# Altium schematic sheet portal.SchDoc
size A4; SheetNumber: 1; SheetTotal: 1
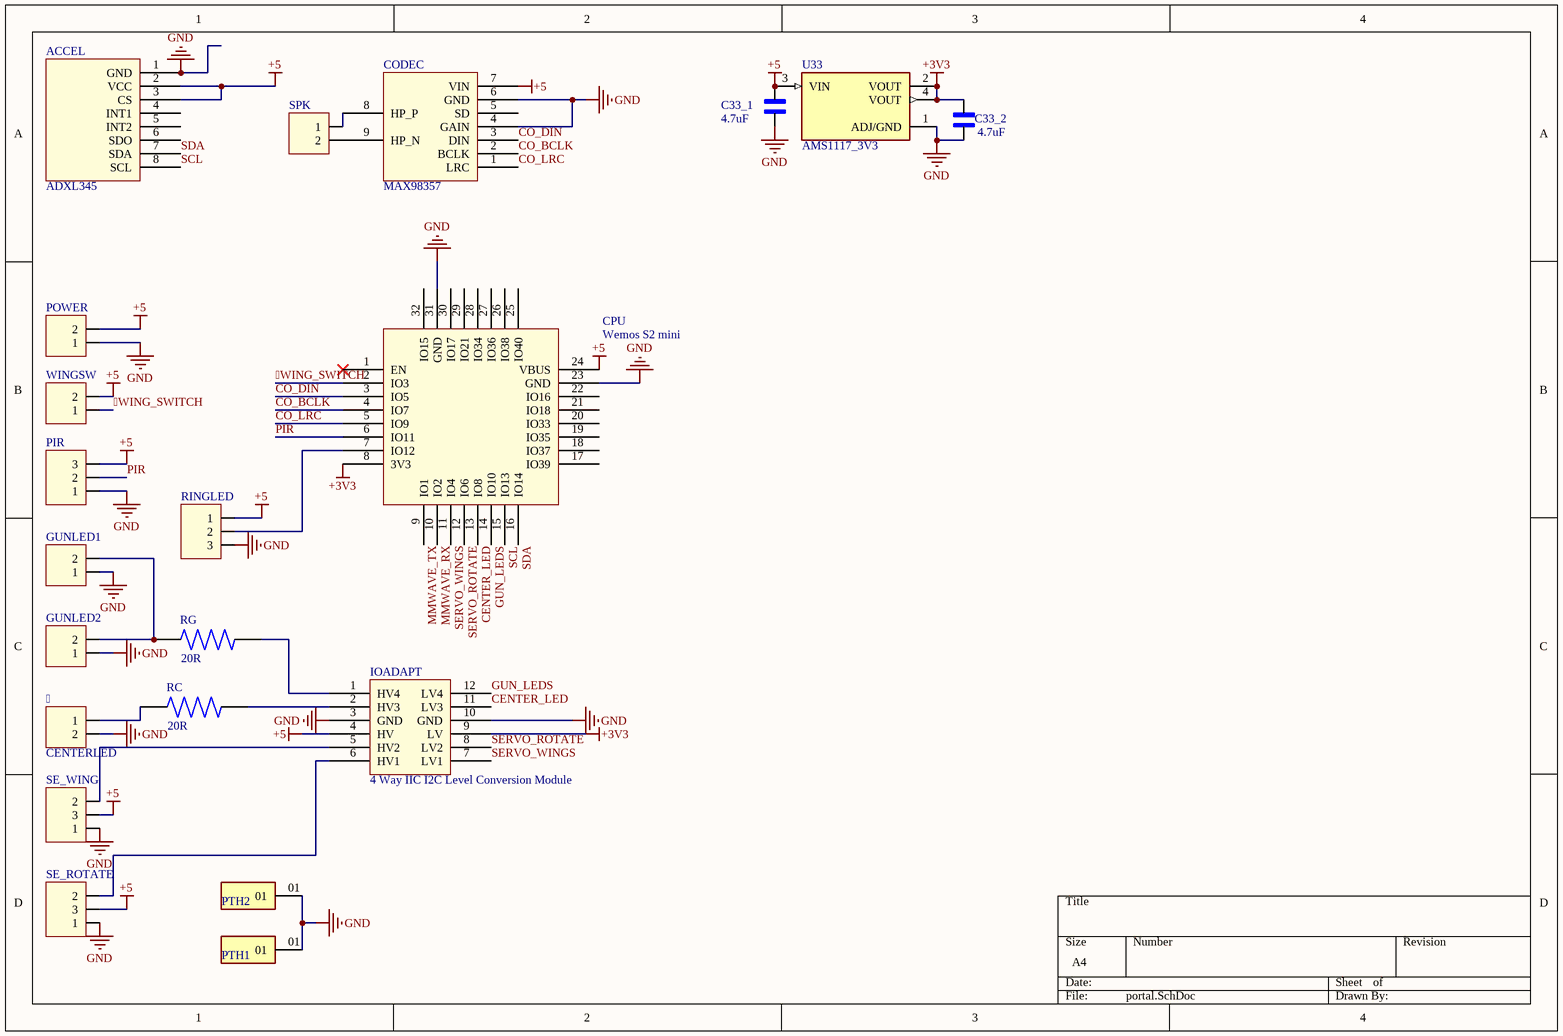
[diagram p0: portal.SchDoc]

## Parts
  CENTERLED  [HEADER 2]
ACCEL  ADXL345  [ADXL345]
C33_1  value 4.7uF  [RESC1508X55N]  (hidden comment: 5uF)
C33_2  value 4.7uF  [RESC1508X55N]  (hidden comment: 5uF)
CODEC  MAX98357  [MAX98357]
CPU  Wemos S2 mini  [WEMOS S2 mini]
GUNLED1  (no value)  [HEADER 2]
GUNLED2  (no value)  [HEADER 2]
IOADAPT  4 Way IIC I2C Level Conversion Module  [IOADAPT]
PIR  (no value)  [HEADER 3]
POWER  (no value)  [HEADER 2]
PTH1  MTSW-101-22-T-S-395  [SAMTEC_MTSW-101-22-T-S-395]  (value not drawn)
PTH2  MTSW-101-22-T-S-395  [SAMTEC_MTSW-101-22-T-S-395]  (value not drawn)
RC  20R  [RESC1607X60N]
RG  20R  [RESC1607X60N]
RINGLED  (no value)  [HEADER 3]
SE_ROTATE  (no value)  [HEADER 3]
SE_WING  (no value)  [HEADER 3]
SPK  (no value)  [HEADER 2]
U33  AMS1117_3V3  [SOT229P700X180-4N]
WINGSW  (no value)  [HEADER 2]

## Nets
+3V3: C33_2.1 CPU.8(3V3) IOADAPT.9(LV) U33.2(VOUT) U33.4(VOUT)
+5: ACCEL.2(VCC) ACCEL.3(CS) C33_1.1 CODEC.7(VIN) CPU.24(VBUS) IOADAPT.4(HV) PIR.3 POWER.2 RINGLED.1 SE_ROTATE.3 SE_WING.3 U33.3(VIN) WINGSW.2
GND: .2 ACCEL.1(GND) C33_1.2 C33_2.2 CODEC.4(GAIN) CODEC.6(GND) CPU.23(GND) CPU.31(GND) GUNLED1.1 GUNLED2.1 IOADAPT.3(GND) IOADAPT.10(GND) PIR.1 POWER.1 PTH1.01 PTH2.01 RINGLED.3 SE_ROTATE.1 SE_WING.1 U33.1(ADJ/GND)
WING_SWITCH: CPU.2(IO3) WINGSW.1
CENTER_LED: CPU.13(IO8) IOADAPT.11(LV3)
CO_BCLK: CODEC.2(BCLK) CPU.4(IO7)
CO_DIN: CODEC.3(DIN) CPU.3(IO5)
CO_LRC: CODEC.1(LRC) CPU.5(IO9)
GUN_LEDS: CPU.14(IO10) IOADAPT.12(LV4)
MMWAVE_RX: CPU.10(IO2)
MMWAVE_TX: CPU.9(IO1)
PIR: CPU.6(IO11) PIR.2
SCL: ACCEL.8(SCL) CPU.15(IO13)
SDA: ACCEL.7(SDA) CPU.16(IO14)
SERVO_ROTATE: CPU.12(IO6) IOADAPT.8(LV2)
SERVO_WINGS: CPU.11(IO4) IOADAPT.7(LV1)
Net_1: .1 RC.1
NetCODEC_8: CODEC.8(HP_P) SPK.1
NetCODEC_9: CODEC.9(HP_N) SPK.2
NetCPU_7: CPU.7(IO12) RINGLED.2
NetGUNLED1_2: GUNLED1.2 GUNLED2.2 RG.1
NetIOADAPT_1: IOADAPT.1(HV4) RG.2
NetIOADAPT_2: IOADAPT.2(HV3) RC.2
NetIOADAPT_5: IOADAPT.5(HV2) SE_WING.2
NetIOADAPT_6: IOADAPT.6(HV1) SE_ROTATE.2

Not connected (* = marked no-connect by the designer): ACCEL 4(INT1) 5(INT2) 6(SDO); CODEC 5(SD); CPU 1(EN)* 17(IO39) 18(IO37) 19(IO35) 20(IO33) 21(IO18) 22(IO16) 25(IO40) 26(IO38) 27(IO36) 28(IO34) 29(IO21) 30(IO17) 32(IO15)

## Library data of the parts
 GUNLED1 GUNLED2 POWER SPK WINGSW = HEADER 2
C33_1 C33_2 = GJM0335C1E220GB01D: MF: {'manufacturer': u'Murata'}; Package: None; Price: None; MP: GJM0335C1E220GB01D; Availability: Unavailable
IOADAPT = IO Adapt
PIR RINGLED SE_ROTATE SE_WING = HEADER 3
PTH1 PTH2 = MTSW-101-22-T-S-395: MF: {'manufacturer': u'Samtec'}; Package: None; Price: None; Value: *; MP: MTSW-101-22-T-S-395; Availability: Unavailable
RC RG = RC0603FR-0720RL: MF: {'manufacturer': u'Yageo'}; Package: None; Price: None; Value: 20R; MP: RC0603FR-0720RL; Availability: Unavailable
U33 = AMS1117: Sot223/Pkg 1-Amp 5-Volt Low Drop Out Voltage Regulatator; MF: {'manufacturer': u'Advanced Monolithic Systems'}; Package: None; Price: None; Value: *; MP: AMS1117; Availability: Unavailable